# EAGLE design 105_vibrator (EAGLE 9.1.0)
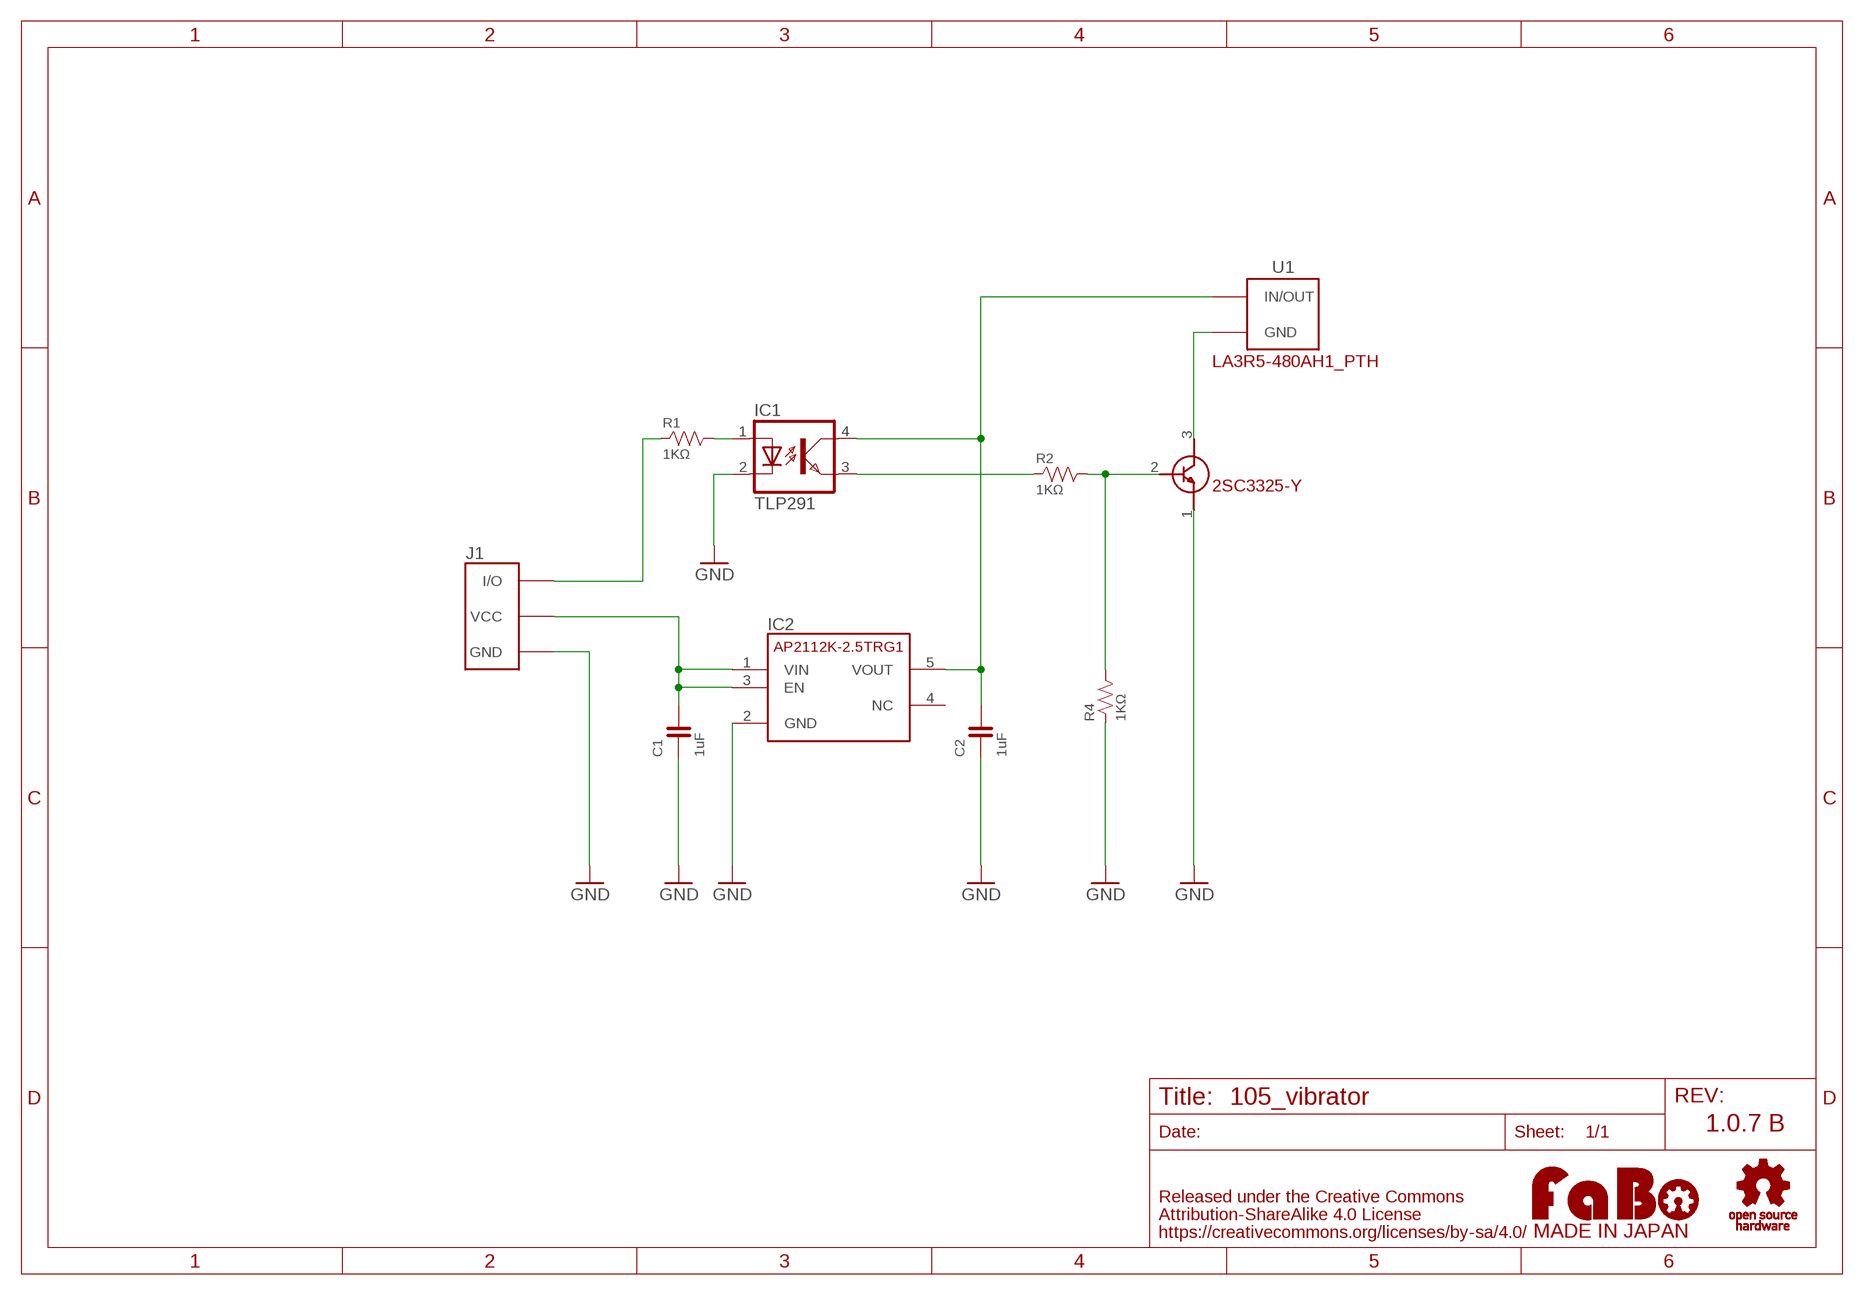
[diagram p0: schematic, sheet 1]

## Parts
C1  1uF  CAPACITOR-0603  [0603]
C2  1uF  CAPACITOR-0603  [0603]
IC1  TLP291  [MINI-FLAT-4]
IC2  AP2112-2.5  [SOT-23-5]
J1  FABO_BRICK_3PIN  [FABO_BRICK_3PIN]
R1  1KΩ  RESISTOR-0603  [0603]
R2  1KΩ  RESISTOR-0603  [0603]
R4  1KΩ  RESISTOR-0603  [0603]
TR1  2SC3325-Y  [SC-59]
U1  VIBRATOR  [LA3R5-480AH1_PTH]
U$2  LOGO_OSHW-M_BOTTOM  [LOGO_OSHW_M_BOTTOM]
U$3  LOGO_FABO-M  [LOGO_FABO_MS]

## Nets
GND: C1.1 C2.1 IC1.2(C) IC2.2(GND) J1.GND R4.1 TR1.1(E)
N$1: J1.I/O R1.1
N$2: IC1.1(A) R1.2
N$3: C1.2 IC2.1(VIN) IC2.3(EN) J1.VCC
N$4: IC1.3(EMIT) R2.1
N$5: C2.2 IC1.4(COL) IC2.5(VOUT) U1.P$1(IN/OUT)
N$7: TR1.3(C) U1.P$2(GND)
N$8: R2.2 R4.2 TR1.2(B)
Unconnected: IC2.4(NC)

## Notes on the sheet
- LA3R5-480AH1_PTH
- 1.0.7 B

## Library data of the parts
C1 C2 = FaBo-Capacitor:CAPACITOR: CAPACITOR
IC1 = FaBo-Transistor:TLP291
IC2 = FaBo-Supply:AP2112-2.5
J1 = FaBo-Template:FABO_BRICK_3PIN: FaBo Brick 3pin
R1 R2 R4 = FaBo-Resistors:RESISTOR: RESISTOR
TR1 = FaBo-Transistor:2SC3325-Y
U1 = FaBo-Parts:VIBRATOR
U$2 = FaBo-etc:LOGO_OSHW
U$3 = FaBo-etc:LOGO_FABO

## Board
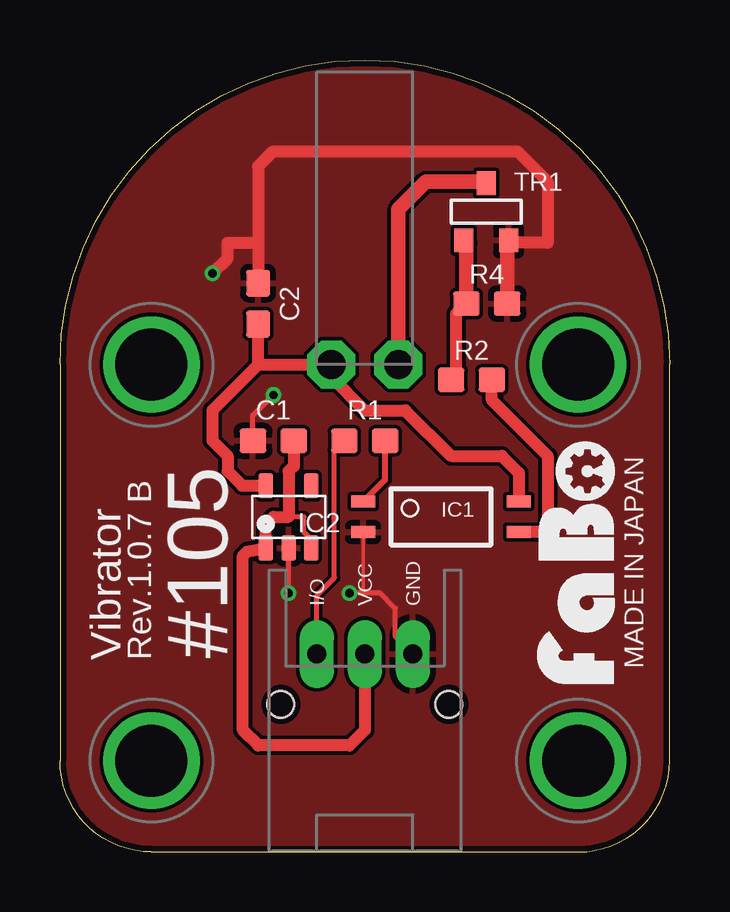
[diagram p1: board, top side]
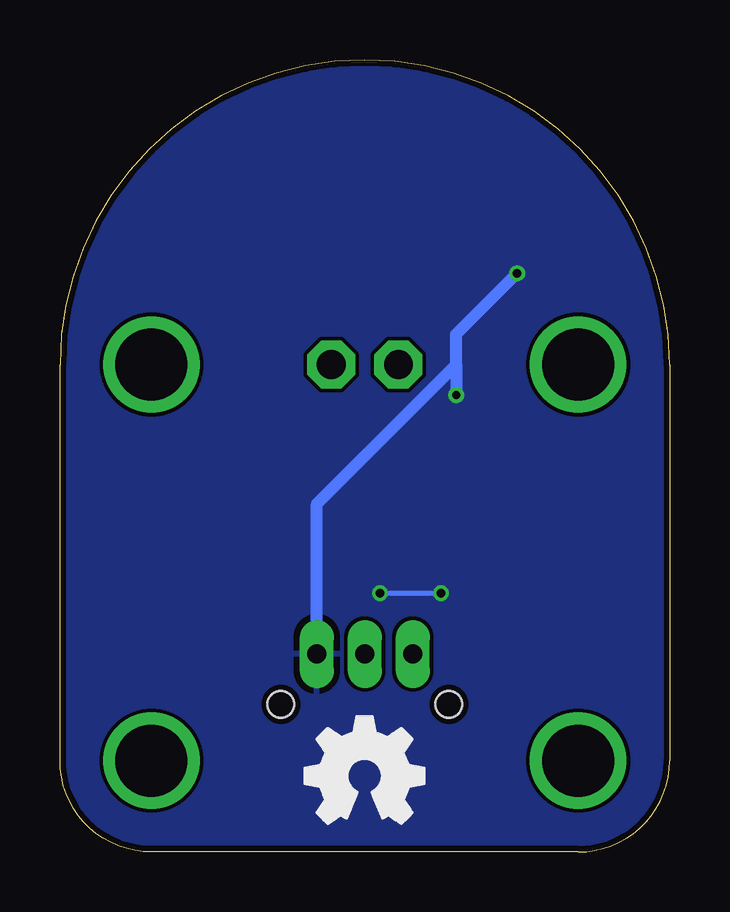
[diagram p2: board, bottom side, seen from below]

Size 25.4 x 33.02 mm. Coordinates in mm from the lower left corner, seen from the top.
Copper layers (1*16): Top 0.035mm / dielectric 1.5mm / Bottom 0.035mm
Design rules "SeeedStudio_2layer_DRU_no_angle_20140221": minimum track width 6mil, minimum drill 12mil, track to track 6mil, track to pad 6mil, pad to pad 6mil, via to via 6mil, smd to smd 0mil, copper to edge 10mil, drill to drill 10mil, minimum pad ring 10mil, minimum via ring 6mil, stop-mask expansion 2mil, vias tented up to drill 100mil, thermal gap 10mil

### Footprints (pad centres in the part's own frame; a part is rotated, then mirrored left to right if it is on the bottom)
0603 = smd 1.1 x 1: 1 -0.85,0; 2 0.85,0
MINI-FLAT-4 = smd 1 x 0.5: 1 -3.24,0.635; 2 -3.24,-0.635; 3 3.24,-0.635; 4 3.24,0.635
SOT-23-5 = smd 0.6 x 1.05: 1 -0.95,-1.3; 2 0,-1.3; 3 0.95,-1.3; 4 0.95,1.3; 5 -0.95,1.3
FABO_BRICK_3PIN = drill 0.8 pad 1.422 long: GND 2,-8.255; I/O -2,-8.255; VCC 0,-8.255 | drill 3 pad 3.81: P$1 -8.89,3.81; P$2 8.89,3.81; P$3 -8.89,-12.7; P$4 8.89,-12.7 | hole 1.1: -3.5,-10.355; 3.5,-10.355
SC-59 = smd 0.787 x 0.991: 1 -0.914,1.168; 2 0.965,1.168; 3 0.025,-1.219
LA3R5-480AH1_PTH = drill 1.2 pad 2 octagon: P$1 -1.4,0; P$2 1.4,0

### Placement (x,y rotation side)
C1  8.89,17.14 0 top
C2  8.26,22.86 270 top
IC1  15.88,13.97 0 top
IC2  9.53,13.97 0 top
J1  12.7,16.51 0 top
R1  12.7,17.14 0 top
R2  17.14,19.68 180 top
R4  17.78,22.86 180 top
TR1  17.78,26.67 180 top
U1  12.7,20.32 0 top
U$2  12.7,3.17 0 top
U$3  23.5,12.06 90 top

### Tracks (layer width: path | path; a pad name or v marks a point on that pad's centre or on a via)
GND  (via drill 0.35)
  Top 0.152: IC1.2 12.63,10.86 12.7,10.79
  Top 0.203: J1.GND 13.97,8.98 13.97,10.16 13.34,10.79 12.7,10.79 v12.06,10.79 | v9.53,10.79 IC2.2 | C1.1 8.04,18.2 v8.89,19.05
  Top 0.508: 8.26,25.4 8.26,28.57 8.89,29.21 19.05,29.21 20.32,27.94 20.32,25.4 18.8,25.4 TR1.1 18.63,25.44 | 8.26,25.4 C2.1 | v6.35,24.13 6.99,24.77 6.99,25.4 8.26,25.4
  Top 0.61: R4.1 18.63,25.44
  Bottom 0.203: v12.06,10.79 v9.53,10.79
  Bottom 0.508: J1.GND 14.7,14.51 8.89,20.32 | 8.89,20.32 v8.89,19.05 | 8.89,20.32 8.89,21.59 v6.35,24.13
  pour Bottom: 0,0 25.4,0 25.4,33.02 0,33.02
  pour Top: 0,0 25.4,0 25.4,33.02 0,33.02
N$1
  Top 0.203: J1.I/O 10.7,10.7 11.43,11.43 11.43,16.73 R1.1
N$2
  Top 0.254: IC1.1 13.55,15.52 R1.2
N$3
  Top 0.203: IC2.3 10.47,13.02 10.16,13.34 10.16,13.97 9.53,13.97
  Top 0.508: J1.VCC 12.7,5.08 12.06,4.45 8.26,4.45 7.62,5.08 7.62,12.35 7.79,12.53 IC2.1 8.57,13.65 8.89,13.97 9.53,13.97 9.53,15.88 9.74,16.09 C1.2
N$4
  Top 0.508: IC1.3 20.32,13.34 20.32,16.51 18,18.84 R2.1
N$5
  Top 0.508: 8.26,20.32 U1.P$1 11.3,19.82 12.7,18.41 14.39,18.41 16.3,16.51 18.41,16.51 19.11,15.81 IC1.4 | 8.26,20.32 6.35,18.41 6.35,17.14 6.99,16.51 6.99,15.88 7.59,15.27 IC2.5 | 8.26,20.32 C2.2
N$7
  Top 0.61: TR1.3 17.7,27.94 15.24,27.94 14.1,26.8 U1.P$2
N$8
  Top 0.508: R2.2 16.51,19.9 16.51,22.44 R4.2 | 16.93,25.39 TR1.2
  Top 0.61: R4.2 16.93,25.39

### Text on the board
tPlace: #105 | MADE IN JAPAN | Vibrator | Rev.1.0.7 B